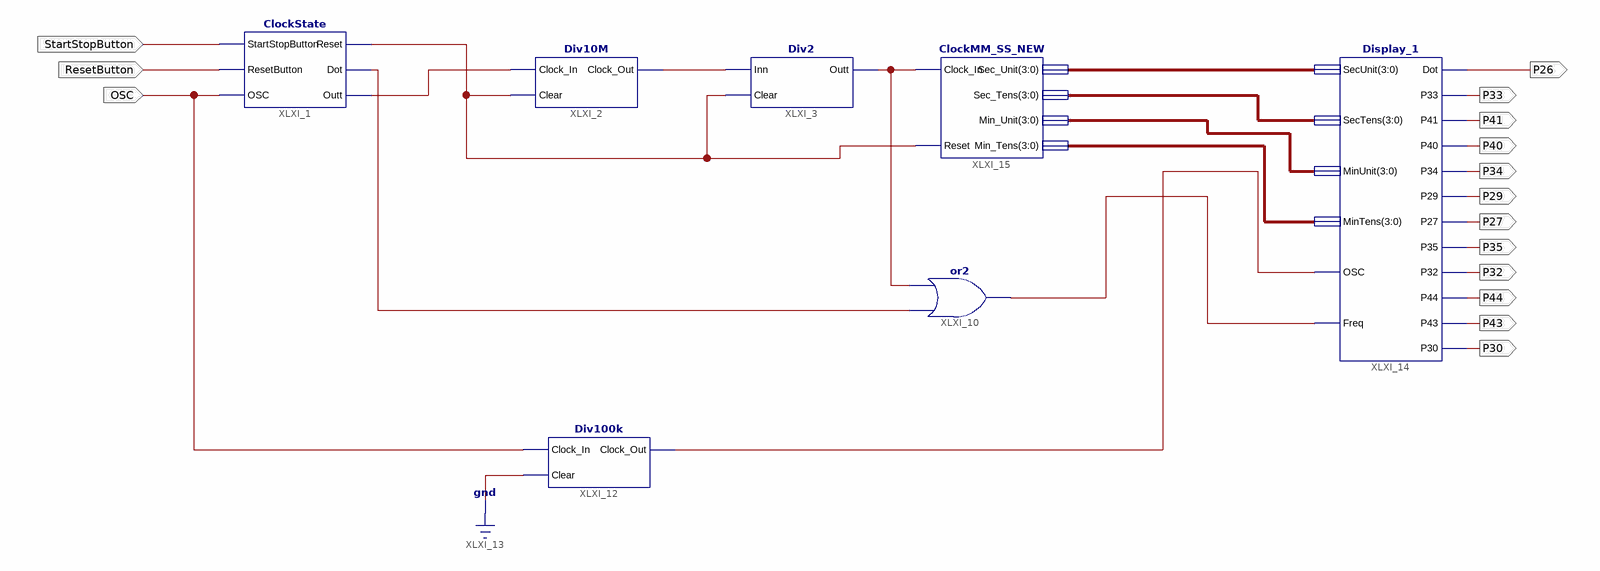
[diagram p0: schematic sheet 1]
// Xilinx ISE schematic main_lab7_10.sch (spartan6) as structural Verilog: 7 symbols, 15 ports
module main_lab7_10 (
  input  StartStopButton,
  input  ResetButton,
  input  OSC,
  output P26,
  output P33,
  output P41,
  output P40,
  output P34,
  output P29,
  output P27,
  output P35,
  output P32,
  output P44,
  output P43,
  output P30
);

  wire XLXN_4, XLXN_5, XLXN_6, XLXN_21, XLXN_23, XLXN_26, XLXN_63;
  wire [3:0] XLXN_16, XLXN_17, XLXN_18, XLXN_19;

  ClockState XLXI_1 (
    .StartStopButton(StartStopButton), .ResetButton(ResetButton), .OSC(OSC), .Reset(XLXN_5), .Dot(XLXN_21),
    .Outt(XLXN_4));
  Div10M XLXI_2 (.Clock_In(XLXN_4), .Clear(XLXN_5), .Clock_Out(XLXN_6));
  Div2 XLXI_3 (.Inn(XLXN_6), .Clear(XLXN_5), .Outt(XLXN_23));
  or XLXI_10 (XLXN_63, XLXN_21, XLXN_23);
  Div100k XLXI_12 (.Clock_In(OSC), .Clear(1'b0), .Clock_Out(XLXN_26));
  Display_1 XLXI_14 (
    .SecUnit(XLXN_16), .SecTens(XLXN_17), .MinUnit(XLXN_18), .MinTens(XLXN_19), .OSC(XLXN_26),
    .Freq(XLXN_63), .Dot(P26), .P33(P33), .P41(P41), .P40(P40), .P34(P34), .P29(P29), .P27(P27), .P35(P35),
    .P32(P32), .P44(P44), .P43(P43), .P30(P30));
  ClockMM_SS_NEW XLXI_15 (
    .Clock_In(XLXN_23), .Reset(XLXN_5), .Sec_Unit(XLXN_16), .Sec_Tens(XLXN_17), .Min_Unit(XLXN_18),
    .Min_Tens(XLXN_19));
endmodule
